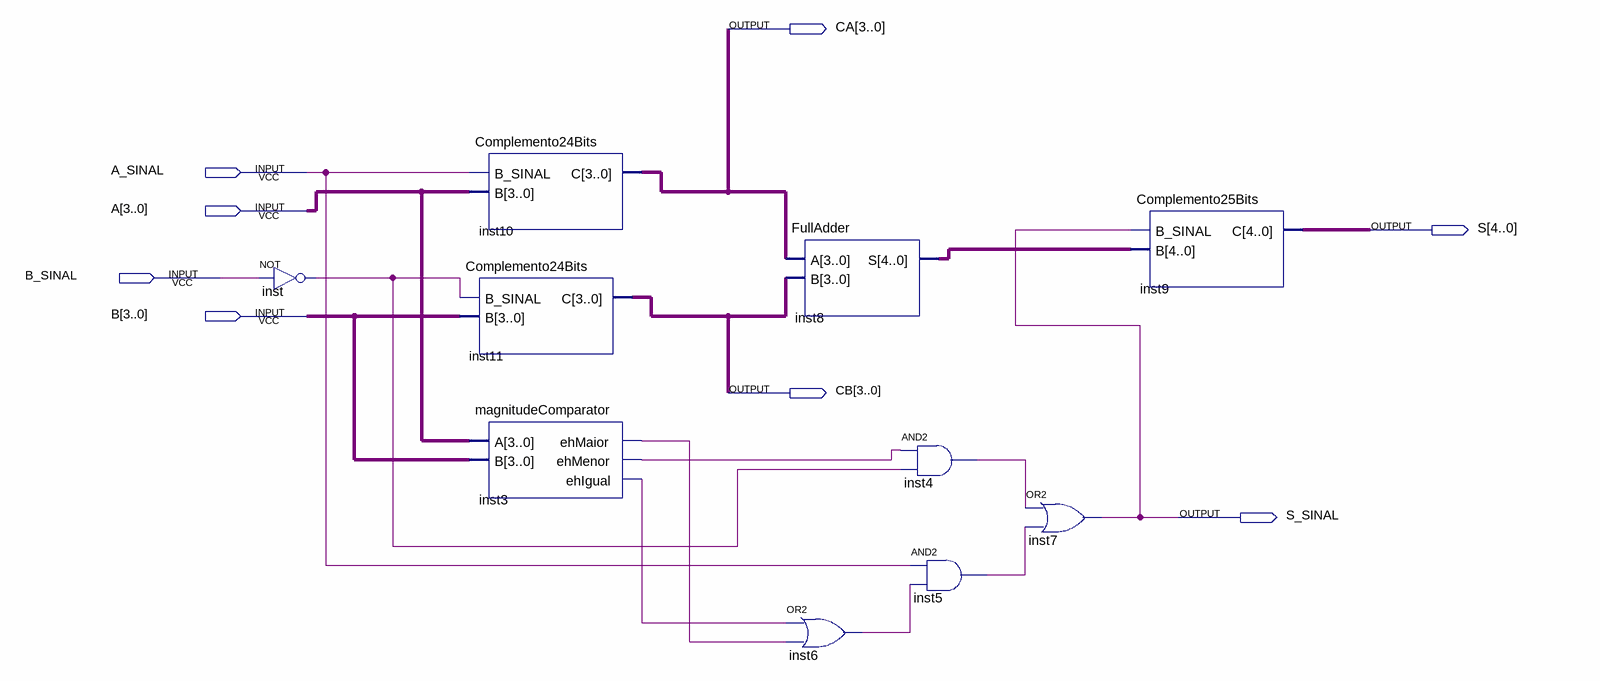
[diagram p0: schematic sheet]
// Quartus schematic Subtrator.bdf as structural Verilog: 10 symbols, 8 pins
module Subtrator (
  input  A_SINAL,
  input  [3:0] A,
  input  B_SINAL,
  input  [3:0] B,
  output [3:0] CA,
  output [4:0] S,
  output [3:0] CB,
  output S_SINAL
);

  wire inst3_ehigual, inst3_ehmaior, inst3_ehmenor, inst4_out, inst5_out, inst6_out, inst_out;
  wire [4:0] inst8_s;

  not inst (inst_out, B_SINAL);
  Complemento24Bits inst10 (.B_SINAL(A_SINAL), .B(A), .C(CA));
  Complemento24Bits inst11 (.B_SINAL(inst_out), .B(B), .C(CB));
  magnitudeComparator inst3 (.A(A), .B(B), .ehMaior(inst3_ehmaior), .ehMenor(inst3_ehmenor), .ehIgual(inst3_ehigual));
  FullAdder inst8 (.A(CA), .B(CB), .S(inst8_s));
  or inst6 (inst6_out, inst3_ehigual, inst3_ehmaior);
  and inst4 (inst4_out, inst3_ehmenor, inst_out);
  and inst5 (inst5_out, A_SINAL, inst6_out);
  or inst7 (S_SINAL, inst4_out, inst5_out);
  Complemento25Bits inst9 (.B_SINAL(S_SINAL), .B(inst8_s), .C(S));
endmodule
